# Altium schematic sheet Transformer FrontEnd 1.SchDoc
size A4
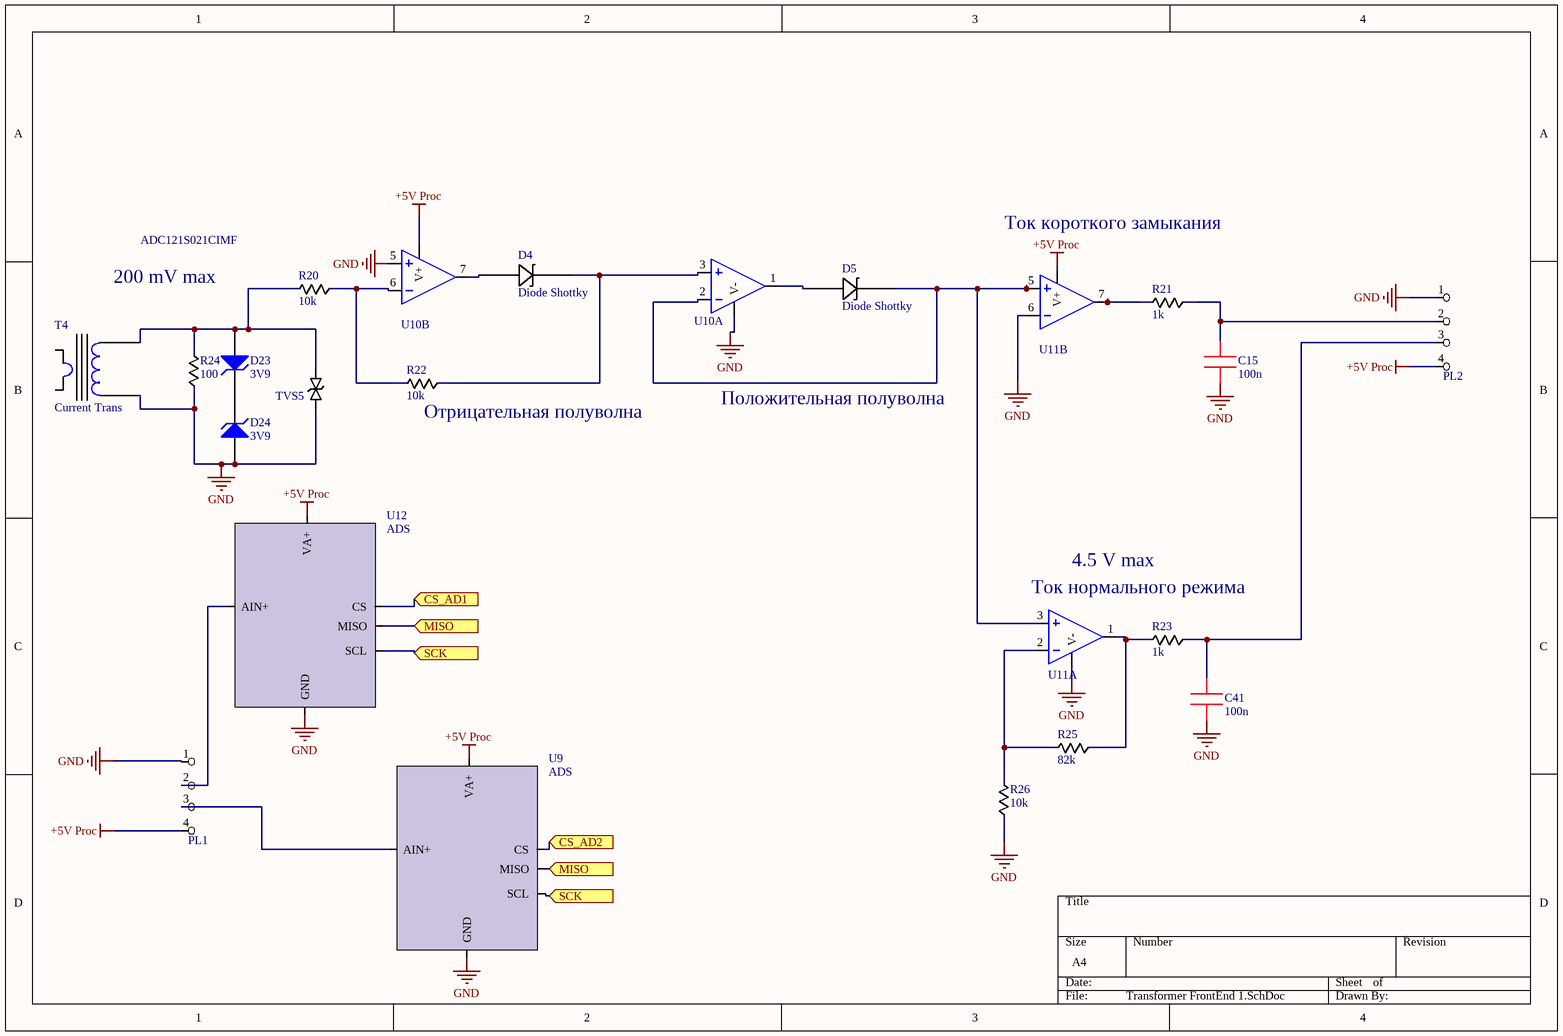
[diagram p0: Transformer FrontEnd 1.SchDoc]

## Parts
C15  100n  [0603]
C41  100n  [0603]
D4  Diode Shottky  [SOD523]
D5  Diode Shottky  [SOD523]
D23  3V9  [SOD80C]
D24  3V9  [SOD80C]
PL1  plug  [PLS 4]  (value not drawn)
PL2  plug  [PLS 4]  (value not drawn)
R20  10k  [0603]
R21  1k  [0603]
R22  10k  [0603]
R23  1k  [0603]
R24  100  [1206]
R25  82k  [0603]
R26  10k  [0603]
T4  Current Trans  [Talema]
TVS5  SMAJ5.0CA  [DO-214AC]  (value not drawn)
U9  ADS  [SOT23 - 6]
U10  OPAMP 2Ch  [SOIC 8]  (value not drawn)  (parts A,B of 2)
U11  OPAMP 2Ch  [SOIC 8]  (value not drawn)  (parts A,B of 2)
U12  ADS  [SOT23 - 6]

## Ports
CS_AD1, CS_AD2, MISO, SCK

## Nets
+5V Proc: PL1.4 PL2.4 U9.1(VA+) U10.8(V+) U11.8(V+) U12.1(VA+)
GND: C15.1 C41.1 D24.1(A) PL1.1 PL2.1 R24.1 R26.1 T4.2 TVS5.1 U9.2(GND) U10.4(V-) U10.5(+IN) U11.4(V-) U11.6(-IN) U12.2(GND)
CS_AD1: U12.6(CS) ; port CS_AD1
CS_AD2: U9.6(CS) ; port CS_AD2
MISO: U9.5(MISO) U12.5(MISO) ; port MISO
SCK: U9.4(SCL) U12.4(SCL) ; port SCK
NetC15_2: C15.2 PL2.2 R21.1
NetC41_2: C41.2 PL2.3 R23.1
NetD4_1: D4.1 U10.7(OUT)
NetD4_2: D4.2 R22.1 U10.3(+IN)
NetD5_1: D5.1 U10.1(OUT)
NetD5_2: D5.2 U10.2(-IN) U11.3(+IN) U11.5(+IN)
NetD23_1: D23.1(A) R20.2 R24.2 T4.1 TVS5.2
NetD23_2: D23.2(K) D24.2(K)
NetPL1_2: PL1.2 U12.3(AIN+)
NetPL1_3: PL1.3 U9.3(AIN+)
NetR20_1: R20.1 R22.2 U10.6(-IN)
NetR21_2: R21.2 U11.7(OUT)
NetR23_2: R23.2 R25.1 U11.1(OUT)
NetR25_2: R25.2 R26.2 U11.2(-IN)

## Notes on the sheet
- ADC121S021CIMF
- Ток короткого замыкания
- 200 mV max
- (near R22) Отрицательная полуволна
- Положительная полуволна
- 4.5 V max
- Ток нормального режима

## Library data of the parts
C15 C41 = 0603 CAP: CC0603KRX7R9BB104
D4 D5 = Diode Shottky: RB751S40T1G
D23 D24 = D Zener: BZV55-C3V9,115
PL1 PL2 = PLS-4R: PLS-4R (DS1022-1x4R)
R20 R22 R26 = 0603 RES: RT0603FRE0710KL
R21 R23 = 0603 RES: RC0603FR-071KL
R24 = SMD Resistor: RT1206BRD07100RL
R25 = 0603 RES: ERJ3EKF8202V
T4 = Current Trans: AC-1005
U9 U12 = ADS: ADC121S021CIMF
U10 U11 = OPAMP 2Ch: TS272IDT